# Altium schematic sheet cambienmua.SchDoc
size A; SheetNumber: 1; SheetTotal: 1
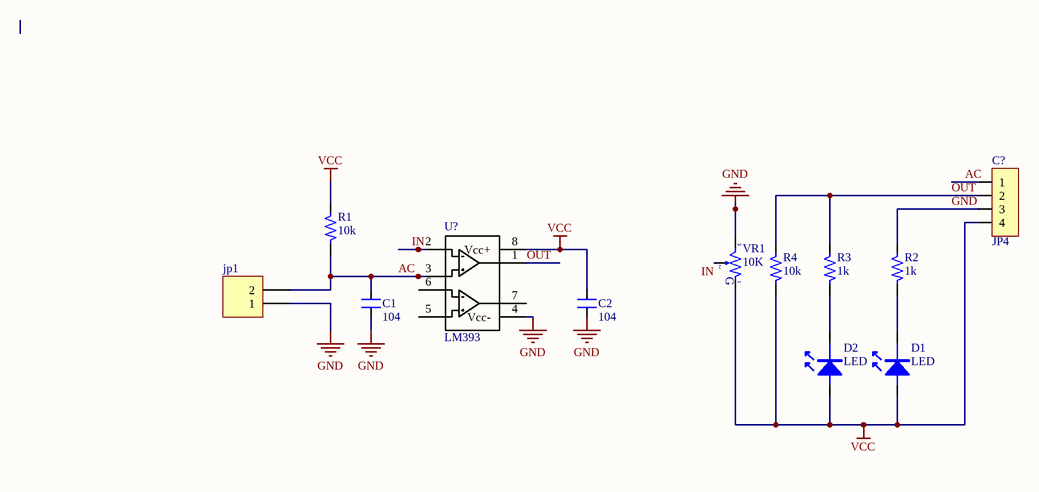
[diagram p0: cambienmua.SchDoc]

## Parts
C1  104  [CN2]
C2  104  [CN2]
C?  JP4  [JP4-D1C]
D1  LED  [CAP10UF]
D2  LED  [CAP10UF]
jp1  Header 2H  [HDR1X2H]  (value not drawn)
R1  10k  [R1/6W]
R2  1k  [R1/6W]
R3  1k  [R1/6W]
R4  10k  [R1/6W]
U?  LM393  [DIP8]
VR1  10K  [VR-S1]

## Nets
GND: C1.2 C2.2 C?.3 jp1.1 R2.1 U?.4(Vcc-) VR1.3
VCC: C2.1 C?.4 D1.1 D2.1 R1.1 R4.2 U?.8(Vcc+) VR1.1
AC: C1.1 C?.1 jp1.2 R1.2 U?.3
IN: U?.2 VR1.2
OUT: C?.2 R3.1 R4.1 U?.1
NetD1_2: D1.2 R2.2
NetD2_2: D2.2 R3.2

Not connected (* = marked no-connect by the designer): U? 5 6 7

## Notes on the sheet
- (in symbol VR-S) G

## Library data of the parts
C1 C2 = CN2: Cap np 104 => 105pF; Value: 0.1uF
C? = JP4: WR-PHD 2.54 mm Angled Socket Header; Manufacturer: W¨¹rth Elektronik eiSos GmbH; partNo: 613004143121; ComponentLink1 Description: Manufacturer; ComponentLink2 Description: Datasheet; NoPins: 04; Created Date: 29 March 2013; ComponentLink1URL: http://www.we-online.com; ComponentLink2URL: http://katalog.we-online.de/em/datasheet/6130xx143121.pdf; Created by: Karrer Zheng
jp1 = Header 2H: Header, 2-Pin, Right Angle; LatestRevisionDate: 17-Jul-2002; LatestRevisionNote: Re-released for DXP Platform.; Publisher: Altium Limited
R1-R4 = Res: Resistor 1/4W; Value: R1/4W - 1K
U? = LM393: IC DUAL COMPARATOR
VR1 = VR-S: Var Resistor; Value: Volume 50k